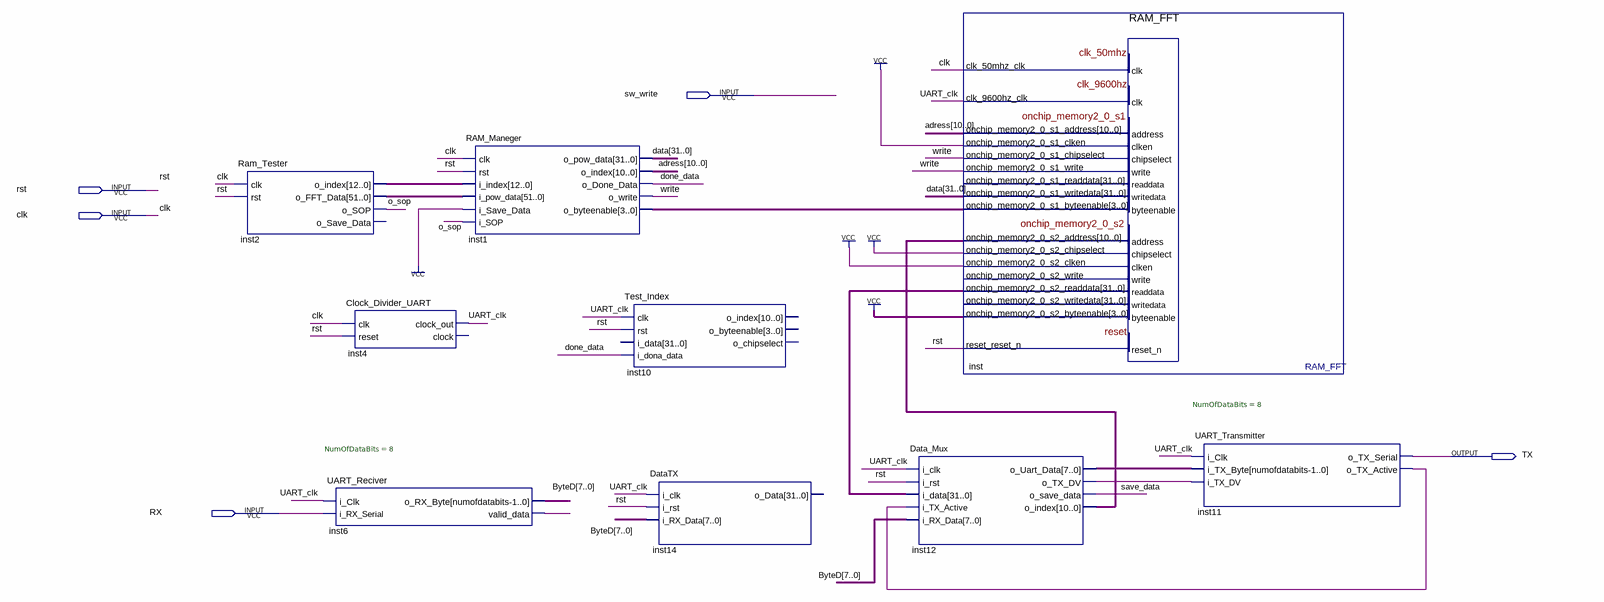
[diagram p0: schematic sheet]
// Quartus schematic RamBDF.bdf as structural Verilog: 9 symbols, 5 pins
module RamBDF (
  input  sw_write,
  input  rst,
  input  clk,
  input  RX,
  output TX
);

  wire done_data, inst6_valid_data, inst11_o_tx_active, inst12_o_tx_dv, o_sop, save_data, UART_clk, write;
  wire [3:0] inst1_o_byteenable;
  wire [7:0] ByteD, inst12_o_uart_data;
  wire [10:0] adress, inst12_o_index;
  wire [12:0] inst2_o_index;
  wire [31:0] data, inst_onchip_memory2_0_s2_readdata;
  wire [51:0] inst2_o_fft_data;

  Ram_Tester inst2 (
    .clk(clk), .rst(rst), .o_index(inst2_o_index), .o_FFT_Data(inst2_o_fft_data), .o_SOP(o_sop));  // open: o_Save_Data
  Clock_Divider_UART inst4 (.clk(clk), .reset(rst), .clock_out(UART_clk));  // open: clock
  UART_Reciver #(.NumOfDataBits(8)) inst6 (
    .i_Clk(UART_clk), .i_RX_Serial(RX), .o_RX_Byte(ByteD), .valid_data(inst6_valid_data));
  RAM_Maneger inst1 (
    .clk(clk), .rst(rst), .i_index(inst2_o_index), .i_pow_data(inst2_o_fft_data), .i_Save_Data(1'b1),
    .i_SOP(o_sop), .o_pow_data(data), .o_index(adress), .o_Done_Data(done_data), .o_write(write),
    .o_byteenable(inst1_o_byteenable));
  Test_Index inst10 (
    .clk(UART_clk), .rst(rst), .i_dona_data(done_data));  // open: i_data, o_index, o_byteenable, o_chipselect
  DataTX inst14 (.i_clk(UART_clk), .i_rst(rst), .i_RX_Data(ByteD));  // open: o_Data
  Data_Mux inst12 (
    .i_clk(UART_clk), .i_rst(rst), .i_data(inst_onchip_memory2_0_s2_readdata),
    .i_TX_Active(inst11_o_tx_active), .i_RX_Data(ByteD), .o_Uart_Data(inst12_o_uart_data),
    .o_TX_DV(inst12_o_tx_dv), .o_save_data(save_data), .o_index(inst12_o_index));
  RAM_FFT inst (
    .clk_50mhz_clk(clk), .clk_9600hz_clk(UART_clk), .onchip_memory2_0_s1_address(adress),
    .onchip_memory2_0_s1_clken(1'b1), .onchip_memory2_0_s1_chipselect(write),
    .onchip_memory2_0_s1_write(write), .onchip_memory2_0_s1_writedata(data),
    .onchip_memory2_0_s1_byteenable(inst1_o_byteenable), .onchip_memory2_0_s2_address(inst12_o_index),
    .onchip_memory2_0_s2_chipselect(1'b1), .onchip_memory2_0_s2_clken(1'b1),
    .onchip_memory2_0_s2_byteenable(4'b1111), .reset_reset_n(rst),
    .onchip_memory2_0_s2_readdata(inst_onchip_memory2_0_s2_readdata));  // open: onchip_memory2_0_s2_write, onchip_memory2_0_s2_writedata, onchip_memory2_0_s1_readdata
  UART_Transmitter #(.NumOfDataBits(8)) inst11 (
    .i_Clk(UART_clk), .i_TX_Byte(inst12_o_uart_data), .i_TX_DV(inst12_o_tx_dv), .o_TX_Serial(TX),
    .o_TX_Active(inst11_o_tx_active));
endmodule
